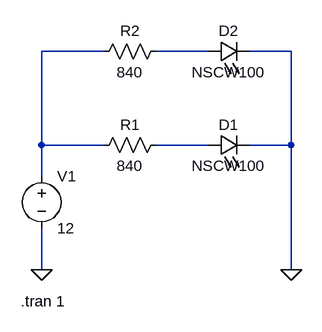
[diagram p0: schematic led-circuit-04.asc]
led-circuit-04.asc, the LTspice schematic file:
Version 4
SHEET 1 880 680
WIRE 224 -48 128 -48
WIRE 384 -48 304 -48
WIRE 512 -48 448 -48
WIRE 128 96 128 -48
WIRE 224 96 128 96
WIRE 384 96 304 96
WIRE 512 96 512 -48
WIRE 512 96 448 96
WIRE 128 144 128 96
WIRE 128 288 128 224
WIRE 512 288 512 96
FLAG 128 288 0
FLAG 512 288 0
SYMBOL voltage 128 128 R0
WINDOW 123 0 0 Left 0
WINDOW 39 0 0 Left 0
SYMATTR InstName V1
SYMATTR Value 12
SYMBOL res 208 112 R270
WINDOW 0 32 56 VTop 2
WINDOW 3 0 56 VBottom 2
SYMATTR InstName R1
SYMATTR Value 840
SYMBOL LED 384 112 R270
WINDOW 0 32 32 VTop 2
WINDOW 3 0 32 VBottom 2
SYMATTR InstName D1
SYMATTR Value NSCW100
SYMATTR Description Diode
SYMATTR Type diode
SYMBOL LED 384 -32 R270
WINDOW 0 32 32 VTop 2
WINDOW 3 0 32 VBottom 2
SYMATTR InstName D2
SYMATTR Value NSCW100
SYMATTR Description Diode
SYMATTR Type diode
SYMBOL res 208 -32 R270
WINDOW 0 32 56 VTop 2
WINDOW 3 0 56 VBottom 2
SYMATTR InstName R2
SYMATTR Value 840
TEXT 96 336 Left 2 !.tran 1

The netlist it stands for:
* led-circuit-04.asc
V1 N001 0 12
R1 N001 N003 840
D1 N003 0 NSCW100
D2 N002 0 NSCW100
R2 N001 N002 840
.model D D
.lib standard.dio
.tran 1
.backanno
.end